# Altium schematic sheet SWITCHING.SchDoc
size 420 x 297 mm; SheetNumber: 6; SheetTotal: 6
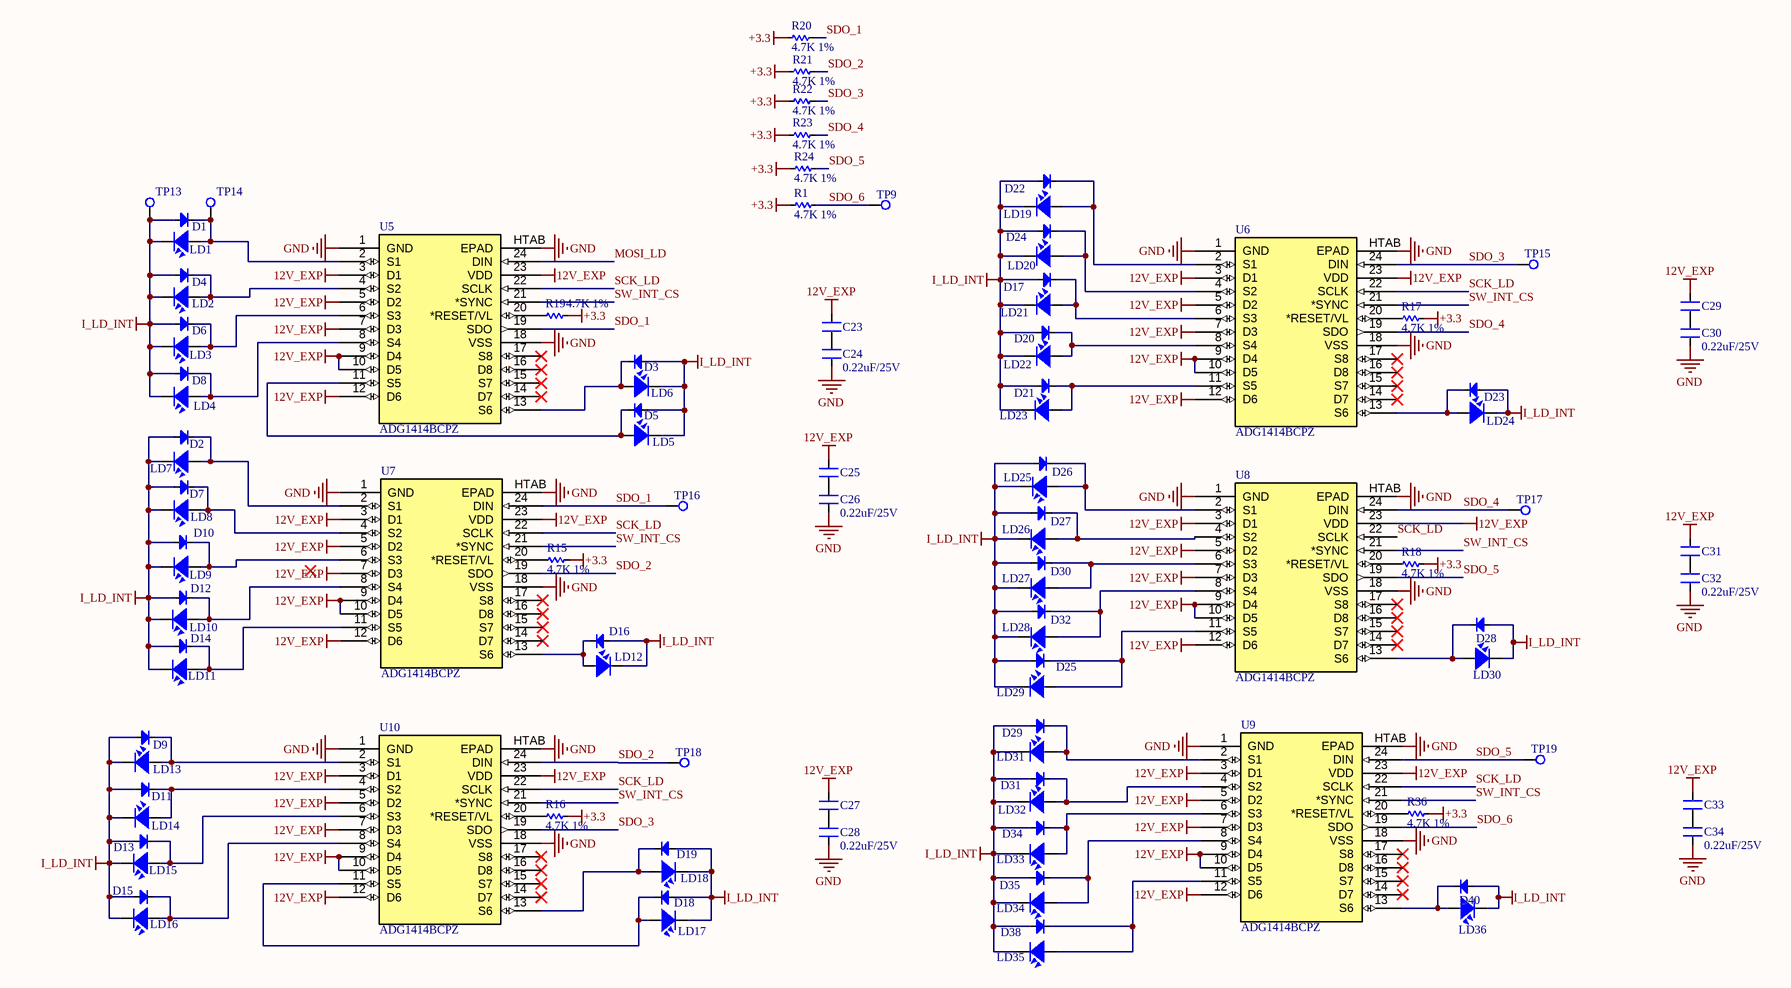
[diagram p0: SWITCHING.SchDoc]

## Parts
C23  0.22uF/25V  [SM-0603]  (value not drawn)
C24  0.22uF/25V  [SM-0603]
C25  0.22uF/25V  [SM-0603]  (value not drawn)
C26  0.22uF/25V  [SM-0603]
C27  0.22uF/25V  [SM-0603]  (value not drawn)
C28  0.22uF/25V  [SM-0603]
C29  0.22uF/25V  [SM-0603]  (value not drawn)
C30  0.22uF/25V  [SM-0603]
C31  0.22uF/25V  [SM-0603]  (value not drawn)
C32  0.22uF/25V  [SM-0603]
C33  0.22uF/25V  [SM-0603]  (value not drawn)
C34  0.22uF/25V  [SM-0603]
D1  1N4148W-TP  [SOD23]  (value not drawn)
D2  1N4148W-TP  [SOD23]  (value not drawn)
D3  1N4148W-TP  [SOD23]  (value not drawn)
D4  1N4148W-TP  [SOD23]  (value not drawn)
D5  1N4148W-TP  [SOD23]  (value not drawn)
D6  1N4148W-TP  [SOD23]  (value not drawn)
D7  1N4148W-TP  [SOD23]  (value not drawn)
D8  1N4148W-TP  [SOD23]  (value not drawn)
D9  1N4148W-TP  [SOD23]  (value not drawn)
D10  1N4148W-TP  [SOD23]  (value not drawn)
D11  1N4148W-TP  [SOD23]  (value not drawn)
D12  1N4148W-TP  [SOD23]  (value not drawn)
D13  1N4148W-TP  [SOD23]  (value not drawn)
D14  1N4148W-TP  [SOD23]  (value not drawn)
D15  1N4148W-TP  [SOD23]  (value not drawn)
D16  1N4148W-TP  [SOD23]  (value not drawn)
D17  1N4148W-TP  [SOD23]  (value not drawn)
D18  1N4148W-TP  [SOD23]  (value not drawn)
D19  1N4148W-TP  [SOD23]  (value not drawn)
D20  1N4148W-TP  [SOD23]  (value not drawn)
D21  1N4148W-TP  [SOD23]  (value not drawn)
D22  1N4148W-TP  [SOD23]  (value not drawn)
D23  1N4148W-TP  [SOD23]  (value not drawn)
D24  1N4148W-TP  [SOD23]  (value not drawn)
D25  1N4148W-TP  [SOD23]  (value not drawn)
D26  1N4148W-TP  [SOD23]  (value not drawn)
D27  1N4148W-TP  [SOD23]  (value not drawn)
D28  1N4148W-TP  [SOD23]  (value not drawn)
D29  1N4148W-TP  [SOD23]  (value not drawn)
D30  1N4148W-TP  [SOD23]  (value not drawn)
D31  1N4148W-TP  [SOD23]  (value not drawn)
D32  1N4148W-TP  [SOD23]  (value not drawn)
D34  1N4148W-TP  [SOD23]  (value not drawn)
D35  1N4148W-TP  [SOD23]  (value not drawn)
D38  1N4148W-TP  [SOD23]  (value not drawn)
D40  1N4148W-TP  [SOD23]  (value not drawn)
LD1  LaserDiode  [LASER_SOCKET]  (value not drawn)
LD2  LaserDiode  [LASER_SOCKET]  (value not drawn)
LD3  LaserDiode  [LASER_SOCKET]  (value not drawn)
LD4  LaserDiode  [LASER_SOCKET]  (value not drawn)
LD5  LaserDiode  [LASER_SOCKET]  (value not drawn)
LD6  LaserDiode  [LASER_SOCKET]  (value not drawn)
LD7  LaserDiode  [LASER_SOCKET]  (value not drawn)
LD8  LaserDiode  [LASER_SOCKET]  (value not drawn)
LD9  LaserDiode  [LASER_SOCKET]  (value not drawn)
LD10  LaserDiode  [LASER_SOCKET]  (value not drawn)
LD11  LaserDiode  [LASER_SOCKET]  (value not drawn)
LD12  LaserDiode  [LASER_SOCKET]  (value not drawn)
LD13  LaserDiode  [LASER_SOCKET]  (value not drawn)
LD14  LaserDiode  [LASER_SOCKET]  (value not drawn)
LD15  LaserDiode  [LASER_SOCKET]  (value not drawn)
LD16  LaserDiode  [LASER_SOCKET]  (value not drawn)
LD17  LaserDiode  [LASER_SOCKET]  (value not drawn)
LD18  LaserDiode  [LASER_SOCKET]  (value not drawn)
LD19  LaserDiode  [LASER_SOCKET]  (value not drawn)
LD20  LaserDiode  [LASER_SOCKET]  (value not drawn)
LD21  LaserDiode  [LASER_SOCKET]  (value not drawn)
LD22  LaserDiode  [LASER_SOCKET]  (value not drawn)
LD23  LaserDiode  [LASER_SOCKET]  (value not drawn)
LD24  LaserDiode  [LASER_SOCKET]  (value not drawn)
LD25  LaserDiode  [LASER_SOCKET]  (value not drawn)
LD26  LaserDiode  [LASER_SOCKET]  (value not drawn)
LD27  LaserDiode  [LASER_SOCKET]  (value not drawn)
LD28  LaserDiode  [LASER_SOCKET]  (value not drawn)
LD29  LaserDiode  [LASER_SOCKET]  (value not drawn)
LD30  LaserDiode  [LASER_SOCKET]  (value not drawn)
LD31  LaserDiode  [LASER_SOCKET]  (value not drawn)
LD32  LaserDiode  [LASER_SOCKET]  (value not drawn)
LD33  LaserDiode  [LASER_SOCKET]  (value not drawn)
LD34  LaserDiode  [LASER_SOCKET]  (value not drawn)
LD35  LaserDiode  [LASER_SOCKET]  (value not drawn)
LD36  LaserDiode  [LASER_SOCKET]  (value not drawn)
R1  4.7K 1%  [RES-SMD-0603]
R15  4.7K 1%  [RES-SMD-0603]
R16  4.7K 1%  [RES-SMD-0603]
R17  4.7K 1%  [RES-SMD-0603]
R18  4.7K 1%  [RES-SMD-0603]
R19  4.7K 1%  [RES-SMD-0603]
R20  4.7K 1%  [RES-SMD-0603]
R21  4.7K 1%  [RES-SMD-0603]
R22  4.7K 1%  [RES-SMD-0603]
R23  4.7K 1%  [RES-SMD-0603]
R24  4.7K 1%  [RES-SMD-0603]
R36  4.7K 1%  [RES-SMD-0603]
TP9  Test_Point  [TESTPOINT]  (value not drawn)
TP13  Test_Point  [TESTPOINT]  (value not drawn)
TP14  Test_Point  [TESTPOINT]  (value not drawn)
TP15  Test_Point  [TESTPOINT]  (value not drawn)
TP16  Test_Point  [TESTPOINT]  (value not drawn)
TP17  Test_Point  [TESTPOINT]  (value not drawn)
TP18  Test_Point  [TESTPOINT]  (value not drawn)
TP19  Test_Point  [TESTPOINT]  (value not drawn)
U5  ADG1414BCPZ  [ADG1414BCPZ]
U6  ADG1414BCPZ  [ADG1414BCPZ]
U7  ADG1414BCPZ  [ADG1414BCPZ]
U8  ADG1414BCPZ  [ADG1414BCPZ]
U9  ADG1414BCPZ  [ADG1414BCPZ]
U10  ADG1414BCPZ  [ADG1414BCPZ]

## Nets
12V_EXP: C23.2 C25.2 C27.2 C29.2 C31.2 C33.2 U5.3(D1) U5.5(D2) U5.7(D3) U5.9(D4) U5.10(D5) U5.12(D6) U5.23(VDD) U6.3(D1) U6.5(D2) U6.7(D3) U6.9(D4) U6.10(D5) U6.12(D6) U6.23(VDD) U7.3(D1) U7.5(D2) U7.7(D3) U7.9(D4) U7.10(D5) U7.12(D6) U7.23(VDD) U8.3(D1) U8.5(D2) U8.7(D3) U8.9(D4) U8.10(D5) U8.12(D6) U8.23(VDD) U9.3(D1) U9.5(D2) U9.7(D3) U9.9(D4) U9.10(D5) U9.12(D6) U9.23(VDD) U10.3(D1) U10.5(D2) U10.7(D3) U10.9(D4) U10.10(D5) U10.12(D6) U10.23(VDD)
+3.3: R1.2 R15.2 R16.2 R17.2 R18.2 R19.2 R20.2 R21.2 R22.2 R23.2 R24.2 R36.2
GND: C24.1 C26.1 C28.1 C30.1 C32.1 C34.1 U5.1(GND) U5.18(VSS) U5.HTAB(EPAD) U6.1(GND) U6.18(VSS) U6.HTAB(EPAD) U7.1(GND) U7.18(VSS) U7.HTAB(EPAD) U8.1(GND) U8.18(VSS) U8.HTAB(EPAD) U9.1(GND) U9.18(VSS) U9.HTAB(EPAD) U10.1(GND) U10.18(VSS) U10.HTAB(EPAD)
I_LD_INT: D1.1(A) D2.1(A) D3.1(A) D4.1(A) D5.1(A) D6.1(A) D7.1(A) D8.1(A) D9.1(A) D10.1(A) D11.1(A) D12.1(A) D13.1(A) D14.1(A) D15.1(A) D16.1(A) D17.1(A) D18.1(A) D19.1(A) D20.1(A) D21.1(A) D22.1(A) D23.1(A) D24.1(A) D25.1(A) D26.1(A) D27.1(A) D28.1(A) D29.1(A) D30.1(A) D31.1(A) D32.1(A) D34.1(A) D35.1(A) D38.1(A) D40.1(A) LD1.3 LD2.3 LD3.3 LD4.3 LD5.3 LD6.3 LD7.3 LD8.3 LD9.3 LD10.3 LD11.3 LD12.3 LD13.3 LD14.3 LD15.3 LD16.3 LD17.3 LD18.3 LD19.3 LD20.3 LD21.3 LD22.3 LD23.3 LD24.3 LD25.3 LD26.3 LD27.3 LD28.3 LD29.3 LD30.3 LD31.3 LD32.3 LD33.3 LD34.3 LD35.3 LD36.3 TP13.1
MOSI_LD: U5.24(DIN)
SCK_LD: U5.22(SCLK) U6.22(SCLK) U7.22(SCLK) U8.22(SCLK) U9.22(SCLK) U10.22(SCLK)
SDO_1: R20.1 TP16.1 U5.19(SDO) U7.24(DIN)
SDO_2: R21.1 TP18.1 U7.19(SDO) U10.24(DIN)
SDO_3: R22.1 TP15.1 U6.24(DIN) U10.19(SDO)
SDO_4: R23.1 TP17.1 U6.19(SDO) U8.24(DIN)
SDO_5: R24.1 TP19.1 U8.19(SDO) U9.24(DIN)
SDO_6: R1.1 TP9.1 U9.19(SDO)
SW_INT_CS: U5.21(*SYNC) U6.21(*SYNC) U7.21(*SYNC) U8.21(*SYNC) U9.21(*SYNC) U10.21(*SYNC)
NetC23_1: C23.1 C24.2
NetC25_1: C25.1 C26.2
NetC27_1: C27.1 C28.2
NetC29_1: C29.1 C30.2
NetC31_1: C31.1 C32.2
NetC33_1: C33.1 C34.2
NetD1_2: D1.2(K) LD1.1 TP14.1 U5.2(S1)
NetD2_2: D2.2(K) LD7.1 U7.2(S1)
NetD3_2: D3.2(K) LD6.1 U5.13(S6)
NetD4_2: D4.2(K) LD2.1 U5.4(S2)
NetD5_2: D5.2(K) LD5.1 U5.11(S5)
NetD6_2: D6.2(K) LD3.1 U5.6(S3)
NetD7_2: D7.2(K) LD8.1 U7.4(S2)
NetD8_2: D8.2(K) LD4.1 U5.8(S4)
NetD9_2: D9.2(K) LD13.1 U10.2(S1)
NetD10_2: D10.2(K) LD9.1 U7.6(S3)
NetD11_2: D11.2(K) LD14.1 U10.4(S2)
NetD12_2: D12.2(K) LD10.1 U7.8(S4)
NetD13_2: D13.2(K) LD15.1 U10.6(S3)
NetD14_2: D14.2(K) LD11.1 U7.11(S5)
NetD15_2: D15.2(K) LD16.1 U10.8(S4)
NetD16_2: D16.2(K) LD12.1 U7.13(S6)
NetD17_2: D17.2(K) LD21.1 U6.6(S3)
NetD18_2: D18.2(K) LD17.1 U10.11(S5)
NetD19_2: D19.2(K) LD18.1 U10.13(S6)
NetD20_2: D20.2(K) LD22.1 U6.8(S4)
NetD21_2: D21.2(K) LD23.1 U6.11(S5)
NetD22_2: D22.2(K) LD19.1 U6.2(S1)
NetD23_2: D23.2(K) LD24.1 U6.13(S6)
NetD24_2: D24.2(K) LD20.1 U6.4(S2)
NetD25_2: D25.2(K) LD29.1 U8.11(S5)
NetD26_2: D26.2(K) LD25.1 U8.2(S1)
NetD27_2: D27.2(K) LD26.1 U8.4(S2)
NetD28_2: D28.2(K) LD30.1 U8.13(S6)
NetD29_2: D29.2(K) LD31.1 U9.2(S1)
NetD30_2: D30.2(K) LD27.1 U8.6(S3)
NetD31_2: D31.2(K) LD32.1 U9.4(S2)
NetD32_2: D32.2(K) LD28.1 U8.8(S4)
NetD34_2: D34.2(K) LD33.1 U9.6(S3)
NetD35_2: D35.2(K) LD34.1 U9.8(S4)
NetD38_2: D38.2(K) LD35.1 U9.11(S5)
NetD40_2: D40.2(K) LD36.1 U9.13(S6)
NetR15_1: R15.1 U7.20(*RESET/VL)
NetR16_1: R16.1 U10.20(*RESET/VL)
NetR17_1: R17.1 U6.20(*RESET/VL)
NetR18_1: R18.1 U8.20(*RESET/VL)
NetR19_1: R19.1 U5.20(*RESET/VL)
NetR36_1: R36.1 U9.20(*RESET/VL)

Not connected (* = marked no-connect by the designer): U5 14(D7)* 15(S7)* 16(D8)* 17(S8)*; U6 14(D7)* 15(S7)* 16(D8)* 17(S8)*; U7 14(D7)* 15(S7)* 16(D8)* 17(S8)*; U8 14(D7)* 15(S7)* 16(D8)* 17(S8)*; U9 14(D7)* 15(S7)* 16(D8)* 17(S8)*; U10 14(D7)* 15(S7)* 16(D8)* 17(S8)*

## Notes on the sheet
- Project:
- BEE-PC1
- Sub-system:
- Design by:
- Hung Nguyen D.
- Bao Bui Q.
- Sheet title:
- Sheet
- A3
- of
- Checked by:
- Approved by:
- Vu Pham
- Revision:
- Document No:
- V1.1.0
- Size:
- Date:

## Library data of the parts
C23-C34 = CM: 0603; Value: 103
D1-D32 D34 D35 D38 D40 = Diode SMD: DIODE GEN PURP 100V 150MA SOD123; Code - JEDEC: DO-214-AB; Value: 1N5007; Published: 8-Jun-2000; Revision: July-2002: Re-released for DXP Platform.; Publisher: Altium Limited
LD1-LD36 = LD
R1 R15-R24 R36 = Res-SMD: 0603; Manufacturer: Generic Components; Class: Passive; Published: 08/06/2000; Publisher: Altium Hobart Technology Centre
U5-U10 = ADG1414: IC SW SPST-NOX8 11.5OHM 24LFCSP